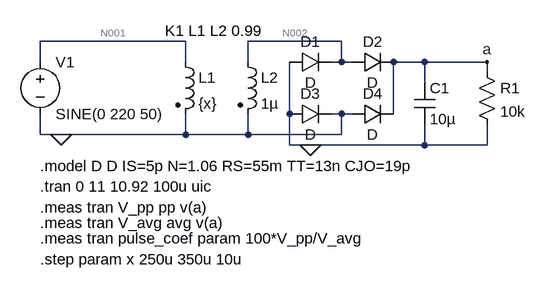
[diagram p0: schematic 2.2.1.asc]
2.2.1.asc, the LTspice schematic file:
Version 4
SHEET 1 1076 680
WIRE 320 80 96 80
WIRE 560 80 416 80
WIRE 96 112 96 80
WIRE 320 112 320 80
WIRE 416 112 416 80
WIRE 560 112 560 80
WIRE 560 112 544 112
WIRE 576 112 560 112
WIRE 688 112 640 112
WIRE 784 112 688 112
WIRE 784 128 784 112
WIRE 688 144 688 112
WIRE 480 192 480 112
WIRE 560 192 544 192
WIRE 576 192 560 192
WIRE 640 192 640 112
WIRE 96 224 96 192
WIRE 128 224 96 224
WIRE 320 224 320 192
WIRE 320 224 128 224
WIRE 416 224 416 192
WIRE 416 224 320 224
WIRE 560 224 560 192
WIRE 560 224 416 224
WIRE 480 240 480 192
WIRE 512 240 480 240
WIRE 688 240 688 208
WIRE 688 240 512 240
WIRE 784 240 784 208
WIRE 784 240 688 240
FLAG 128 224 0
FLAG 784 112 a
FLAG 512 240 0
SYMBOL voltage 96 96 R0
WINDOW 123 0 0 Left 0
WINDOW 39 0 0 Left 0
SYMATTR InstName V1
SYMATTR Value SINE(0 220 50)
SYMBOL ind2 304 96 R0
SYMATTR InstName L1
SYMATTR Value {x}
SYMATTR SpiceLine Rser=10m
SYMATTR Type ind
SYMBOL ind2 400 96 R0
SYMATTR InstName L2
SYMATTR Value 1µ
SYMATTR SpiceLine Rser=10m
SYMATTR Type ind
SYMBOL cap 672 144 R0
SYMATTR InstName C1
SYMATTR Value 10µ
SYMBOL res 768 112 R0
SYMATTR InstName R1
SYMATTR Value 10k
SYMBOL diode 480 128 R270
WINDOW 0 32 32 VTop 2
WINDOW 3 0 32 VBottom 2
SYMATTR InstName D1
SYMBOL diode 576 128 R270
WINDOW 0 32 32 VTop 2
WINDOW 3 0 32 VBottom 2
SYMATTR InstName D2
SYMBOL diode 480 208 R270
WINDOW 0 32 32 VTop 2
WINDOW 3 0 32 VBottom 2
SYMATTR InstName D3
SYMBOL diode 576 208 R270
WINDOW 0 32 32 VTop 2
WINDOW 3 0 32 VBottom 2
SYMATTR InstName D4
TEXT 96 272 Left 2 !.model D D IS=5p N=1.06 RS=55m TT=13n CJO=19p
TEXT 288 64 Left 2 !K1 L1 L2 0.99
TEXT 96 304 Left 2 !.tran 0 11 10.92 100u uic
TEXT 96 336 Left 2 !.meas tran V_pp pp v(a)
TEXT 96 360 Left 2 !.meas tran V_avg avg v(a)
TEXT 96 384 Left 2 !.meas tran pulse_coef param 100*V_pp/V_avg
TEXT 96 416 Left 2 !.step param x 250u 350u 10u

The netlist it stands for:
* 2.2.1.asc
V1 N001 0 SINE(0 220 50)
L1 N001 0 {x} Rser=10m
L2 N002 0 1µ Rser=10m
C1 a 0 10µ
R1 a 0 10k
D1 0 N002 D
D2 N002 a D
D3 0 0 D
D4 0 a D
.model D D
.lib standard.dio
.model D D IS=5p N=1.06 RS=55m TT=13n CJO=19p
K1 L1 L2 0.99
.tran 0 11 10.92 100u uic
.meas tran V_pp pp v(a)
.meas tran V_avg avg v(a)
.meas tran pulse_coef param 100*V_pp/V_avg
.step param x 250u 350u 10u
.backanno
.end

* Results of the author's LTspice run, read from the files saved beside the schematic
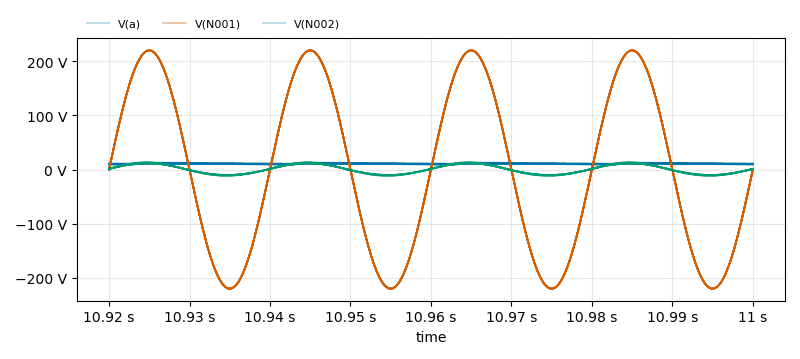
[diagram p1: Transient Analysis of 2.2.1.asc, plotted from the saved traces]
* Transient Analysis, 11 runs:
*   V(a) [x=0.00025]: min 10.97 V, max 13.12 V, average 12.05 V, rms 12.07 V, last 11.27 V
*   V(a) [x=0.00026]: min 10.75 V, max 12.86 V, average 11.82 V, rms 11.83 V, last 11.06 V
*   V(a) [x=0.00027]: min 10.55 V, max 12.62 V, average 11.59 V, rms 11.61 V, last 10.85 V
*   V(a) [x=0.00028]: min 10.36 V, max 12.39 V, average 11.38 V, rms 11.4 V, last 10.65 V
*   V(a) [x=0.00029]: min 10.17 V, max 12.17 V, average 11.18 V, rms 11.2 V, last 10.47 V
*   V(a) [x=0.0003]: min 10 V, max 11.96 V, average 10.99 V, rms 11.01 V, last 10.29 V
*   V(a) [x=0.00031]: min 9.835 V, max 11.76 V, average 10.81 V, rms 10.82 V, last 10.12 V
*   V(a) [x=0.00032]: min 9.677 V, max 11.57 V, average 10.63 V, rms 10.65 V, last 9.957 V
*   V(N001) [x=0.00025]: min -219.9 V, max 220 V, average 23.76 mV, rms 155.6 V, last 0 V
*   V(N001) [x=0.00026]: min -219.8 V, max 220 V, average 24.93 mV, rms 155.6 V, last 0 V
*   V(N001) [x=0.00027]: min -219.8 V, max 220 V, average 24.55 mV, rms 155.6 V, last 0 V
*   V(N001) [x=0.00028]: min -219.9 V, max 220 V, average 23.02 mV, rms 155.6 V, last 0 V
*   V(N001) [x=0.00029]: min -219.8 V, max 220 V, average 23.81 mV, rms 155.6 V, last 0 V
*   V(N001) [x=0.0003]: min -219.9 V, max 220 V, average 24.45 mV, rms 155.6 V, last 0 V
*   V(N001) [x=0.00031]: min -220 V, max 220 V, average 24.02 mV, rms 155.6 V, last 0 V
*   V(N001) [x=0.00032]: min -220 V, max 220 V, average 24.24 mV, rms 155.6 V, last 0 V
*   V(N002) [x=0.00025]: min -11.69 V, max 13.66 V, average 606.2 mV, rms 9 V, last 1.723 V
*   V(N002) [x=0.00026]: min -11.47 V, max 13.4 V, average 593.8 mV, rms 8.831 V, last 1.626 V
*   V(N002) [x=0.00027]: min -11.26 V, max 13.16 V, average 581.9 mV, rms 8.672 V, last 1.539 V
*   V(N002) [x=0.00028]: min -11.07 V, max 12.93 V, average 570.5 mV, rms 8.521 V, last 1.458 V
*   V(N002) [x=0.00029]: min -10.88 V, max 12.71 V, average 559.9 mV, rms 8.377 V, last 1.385 V
*   V(N002) [x=0.0003]: min -10.7 V, max 12.5 V, average 549.8 mV, rms 8.241 V, last 1.317 V
*   V(N002) [x=0.00031]: min -10.54 V, max 12.3 V, average 540 mV, rms 8.11 V, last 1.255 V
*   V(N002) [x=0.00032]: min -10.38 V, max 12.11 V, average 530.8 mV, rms 7.986 V, last 1.197 V
* From the log:
*   Measurement: v_pp
*     step  PP(v(a))  FROM  TO
*        1  2.15081  0  0.08
*        2  2.10869  0  0.08
*        3  2.06836  0  0.08
*        4  2.0306  0  0.08
*        5  1.99462  0  0.08
*        6  1.96011  0  0.08
*        7  1.9275  0  0.08
*        8  1.89638  0  0.08
*        9  1.86636  0  0.08
*       10  1.83773  0  0.08
*       11  1.81046  0  0.08
*   Measurement: v_avg
*     step  AVG(v(a))  FROM  TO
*        1  12.0532  0  0.08
*        2  11.8175  0  0.08
*        3  11.5944  0  0.08
*        4  11.3827  0  0.08
*        5  11.1817  0  0.08
*        6  10.9904  0  0.08
*        7  10.8081  0  0.08
*        8  10.6342  0  0.08
*        9  10.4679  0  0.08
*       10  10.3088  0  0.08
*       11  10.1564  0  0.08
*   Measurement: pulse_coef
*     step  100*v_pp/v_avg
*        1  17.8444
*        2  17.8438
*        3  17.8394
*        4  17.8393
*        5  17.8383
*        6  17.8348
*        7  17.8339
*        8  17.8329
*        9  17.8294
*       10  17.8269
*       11  17.8259